# Altium schematic sheet 基于单片机的无线红外防盗报警系统原理图.SchDoc
size A2
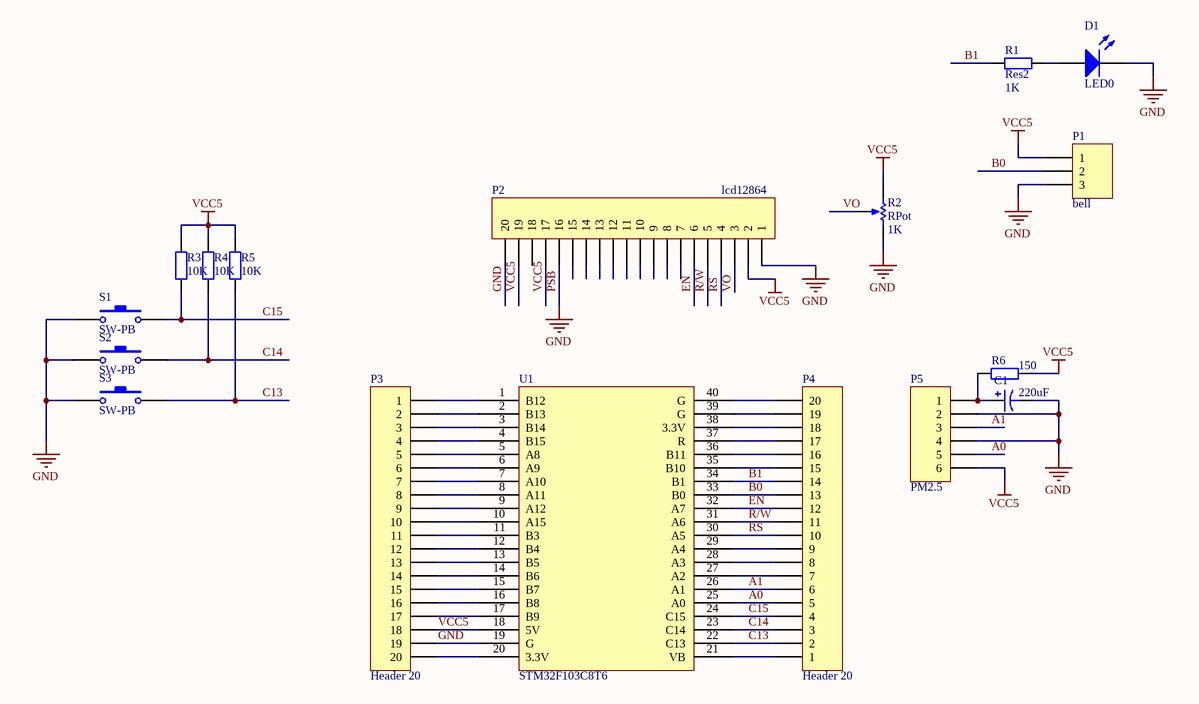
[diagram p0: 基于单片机的无线红外防盗报警系统原理图.SchDoc]

## Parts
C1  value 220uF  [RB.1/.3A]  (hidden comment: Cap Pol1)
D1  LED0  [LED0.1]
P1  bell  [HDR1X3]
P2  lcd12864  [HDR1X20]
P3  Header 20  [HDR1X20]
P4  Header 20  [HDR1X20]
P5  PM2.5  [HDR1X6]
R1  Res2  value 1K  [0805]
R2  RPot  value 1K  [VR5]
R3  value 10K  [LC-0805_R]  (hidden comment: Res2)
R4  value 10K  [LC-0805_R]  (hidden comment: Res2)
R5  value 10K  [LC-0805_R]  (hidden comment: Res2)
R6  value 150  [LC-0805_R]  (hidden comment: Res2)
S1  SW-PB  [SW-PB2]
S2  SW-PB  [SW-PB2]
S3  SW-PB  [SW-PB2]
U1  STM32F103C8T6  [132]

## Nets
GND: C1.2 D1.2(K) P1.3 P2.1 P2.16 P2.20 P3.19 P5.2 P5.4 R2.2(BOT) S1.1 S2.1 S3.1 U1.19(G)  [also labelled PSB]
VCC5: P1.1 P2.2 P2.17 P2.19 P3.18 P5.6 R2.1(TOP) R3.2 R4.2 R5.2 R6.2 U1.18(5V)
A0: P4.5 P5.5 U1.25(A0)
A1: P4.6 P5.3 U1.26(A1)
B0: P1.2 P4.13 U1.33(B0)
B1: P4.14 R1.1 U1.34(B1)
C13: P4.2 R5.1 S3.2 U1.22(C13)
C14: P4.3 R4.1 S2.2 U1.23(C14)
C15: P4.4 R3.1 S1.2 U1.24(C15)
EN: P2.6 P4.12 U1.32(A7)
R/W: P2.5 P4.11 U1.31(A6)
RS: P2.4 P4.10 U1.30(A5)
VO: P2.3 R2.3(TAP)
NetC1_1: C1.1 P5.1 R6.1
NetD1_1: D1.1(A) R1.2
NetP3_1: P3.1 U1.1(B12)
NetP3_2: P3.2 U1.2(B13)
NetP3_3: P3.3 U1.3(B14)
NetP3_4: P3.4 U1.4(B15)
NetP3_5: P3.5 U1.5(A8)
NetP3_6: P3.6 U1.6(A9)
NetP3_7: P3.7 U1.7(A10)
NetP3_8: P3.8 U1.8(A11)
NetP3_9: P3.9 U1.9(A12)
NetP3_10: P3.10 U1.10(A15)
NetP3_11: P3.11 U1.11(B3)
NetP3_12: P3.12 U1.12(B4)
NetP3_13: P3.13 U1.13(B5)
NetP3_14: P3.14 U1.14(B6)
NetP3_15: P3.15 U1.15(B7)
NetP3_16: P3.16 U1.16(B8)
NetP3_17: P3.17 U1.17(B9)
NetP3_20: P3.20 U1.20(3.3V)
NetP4_1: P4.1 U1.21(VB)
NetP4_7: P4.7 U1.27(A2)
NetP4_8: P4.8 U1.28(A3)
NetP4_9: P4.9 U1.29(A4)
NetP4_15: P4.15 U1.35(B10)
NetP4_16: P4.16 U1.36(B11)
NetP4_17: P4.17 U1.37(R)
NetP4_18: P4.18 U1.38(3.3V)
NetP4_19: P4.19 U1.39(G)
NetP4_20: P4.20 U1.40(G)

Not connected (* = marked no-connect by the designer): P2 7 8 9 10 11 12 13 14 15 18

## Library data of the parts
C1 = Cap Pol1: Polarized Capacitor (Radial); Published: 8-Jun-2000; LatestRevisionDate: 17-Jul-2002; LatestRevisionNote: Re-released for DXP Platform.; PackageReference: RB7.6-15; Publisher: Altium Limited; PackageDescription: Polarized Capacitor (Radial); 2 Leads
D1 = LED0: Typical INFRARED GaAs LED; Published: 8-Jun-2000; LatestRevisionDate: 08-Jul-2005; LatestRevisionNote: Mech Layer 1 removed.; PackageReference: LED-0; Publisher: Altium Limited; PackageDescription: LED; 2 Leads
P1 = Header 3: Header, 3-Pin; LatestRevisionDate: 17-Jul-2002; LatestRevisionNote: Re-released for DXP Platform.; Publisher: Altium Limited
P2-P4 = Header 20: Header, 20-Pin; LatestRevisionDate: 17-Jul-2002; LatestRevisionNote: Re-released for DXP Platform.; Publisher: Altium Limited
P5 = Header 6: Header, 6-Pin; LatestRevisionDate: 17-Jul-2002; LatestRevisionNote: Re-released for DXP Platform.; Publisher: Altium Limited
R1 R3-R6 = Res2: Resistor; Published: 8-Jun-2000; LatestRevisionDate: 17-Jul-2002; LatestRevisionNote: Re-released for DXP Platform.; PackageReference: AXIAL-0.4; Publisher: Altium Limited; PackageDescription: Axial Device, Thru-Hole; 2 Leads; 0.4 in Pin Spacing
R2 = RPot: Potentiometer; Sim Note: Enter the Resistance value and the set point into parameter fields.; Set Position: 0.5; Published: 8-Jun-2000; LatestRevisionDate: 17-Jul-2002; LatestRevisionNote: Re-released for DXP Platform.; PackageReference: VR5; Publisher: Altium Limited; PackageDescription: Variable Resistor, Thru-Hole; 3 Leads
S1-S3 = SW-PB: Switch; Published: 24-Mar-1999; LatestRevisionDate: 17-Jul-2002; LatestRevisionNote: Re-released for DXP Platform.; PackageReference: SPST-2; Publisher: Altium Limited; PackageDescription: Switch; 2 Leads
U1 = Component_1